# EAGLE schematic Template (EAGLE 6.5.0)
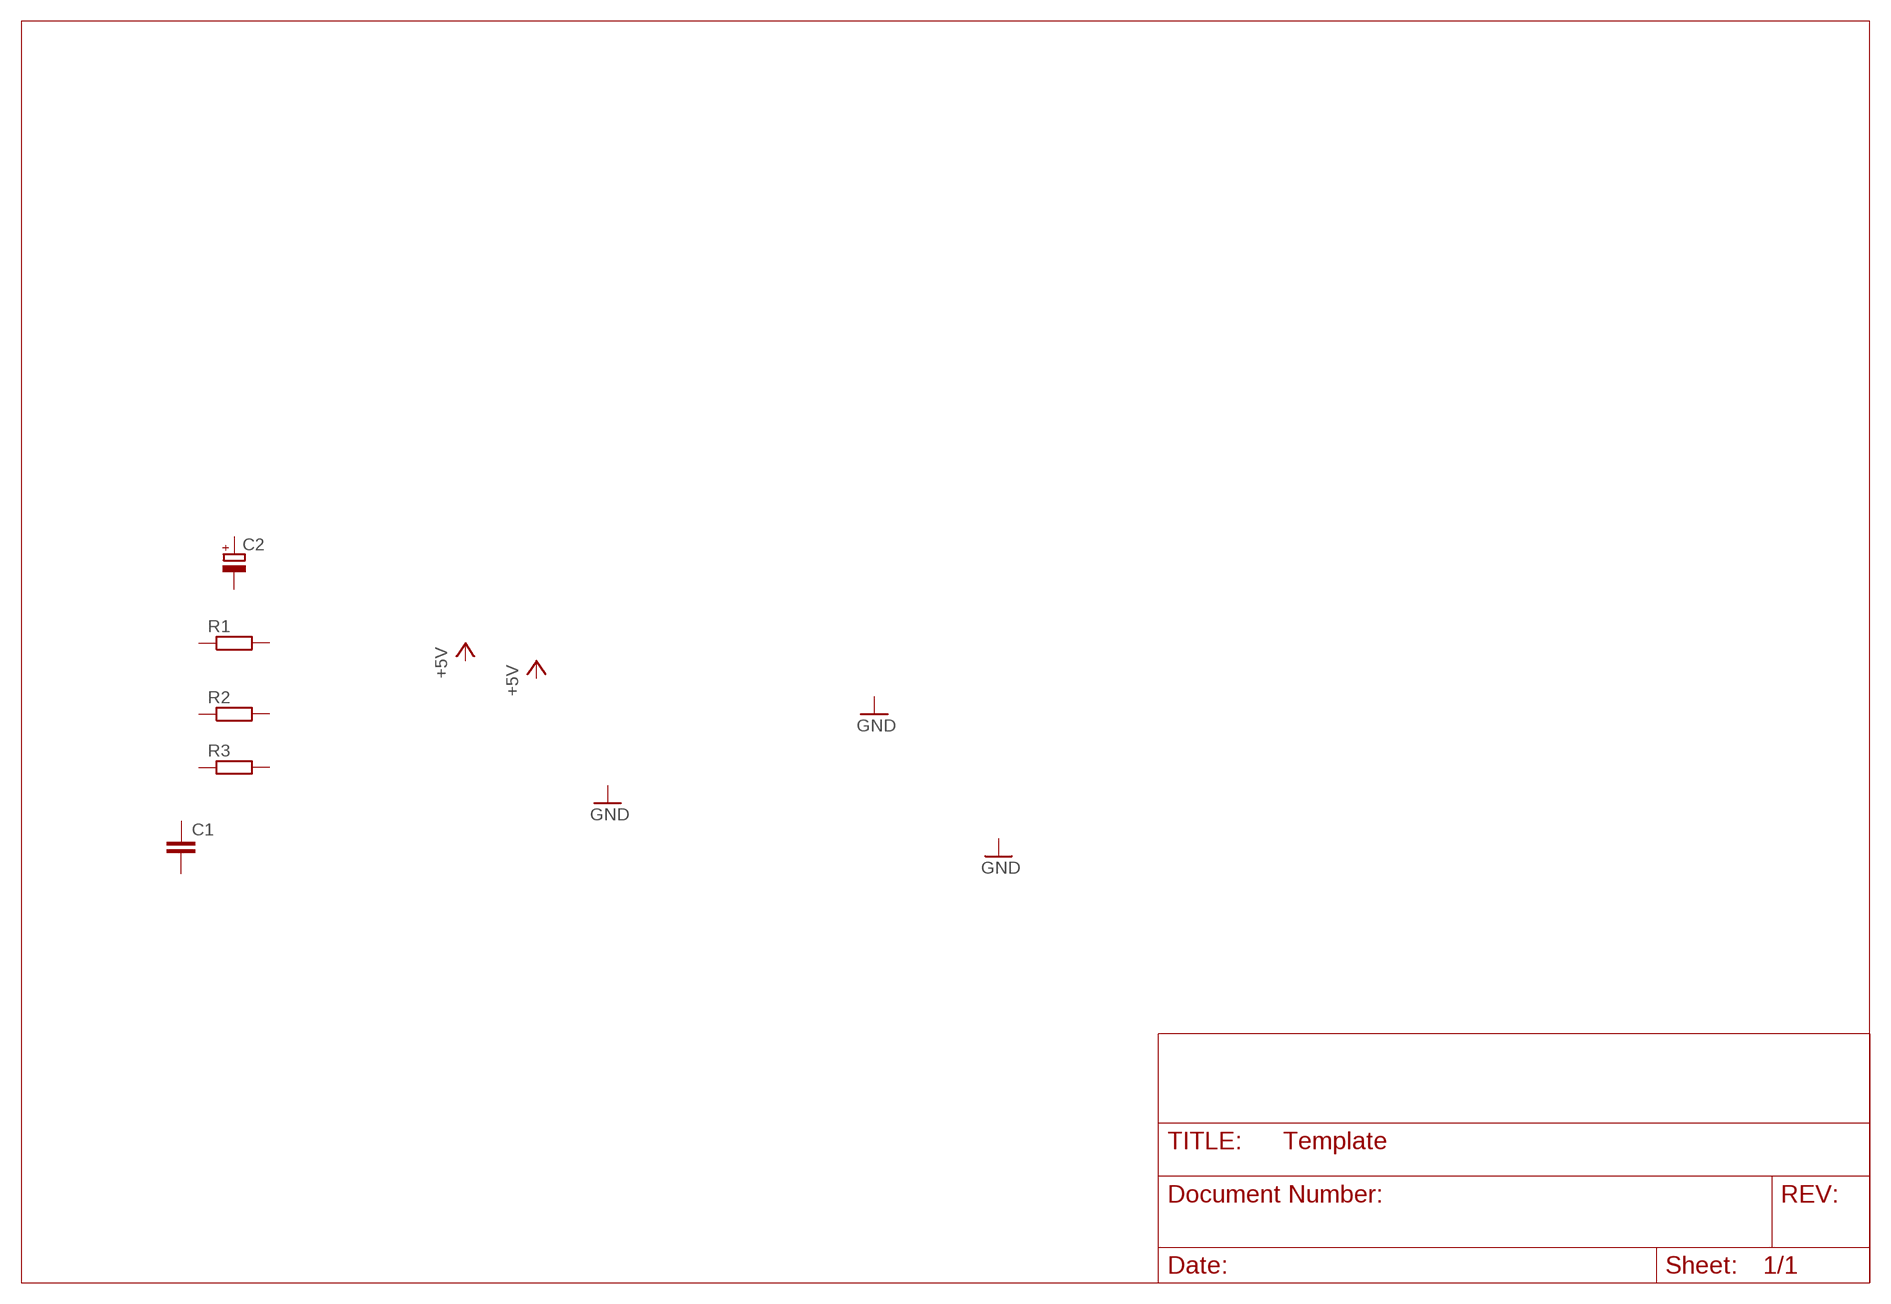
[diagram p0: schematic, sheet 1]

## Parts
C1  C-EU025_050-025X075  [C025_050-025X075]
C2  CPOL-EUE2.5-6  [E2,5-6]
R1  R-EU_0207/10  [0207/10]
R2  R-EU_0207/10  [0207/10]
R3  R-EU_0207/10  [0207/10]
Unconnected: C1.1 C1.2 C2.+ C2.- R1.1 R1.2 R2.1 R2.2 R3.1 R3.2

## Library data of the parts
C1 = rcl:C-EU: CAPACITOR, European symbol
C2 = rcl:CPOL-EU: POLARIZED CAPACITOR, European symbol
R1-R3 = rcl:R-EU_: RESISTOR, European symbol